# EAGLE design IR_beacon (EAGLE 9.2.2)
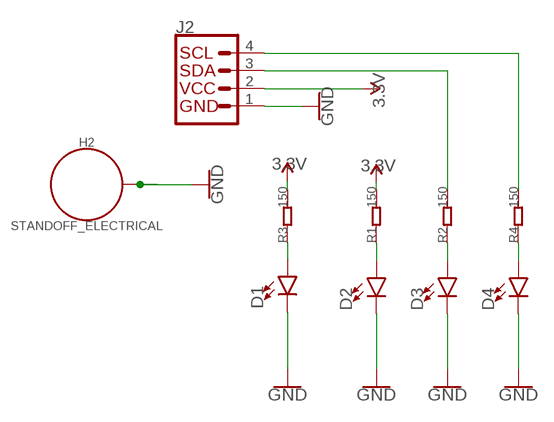
[diagram p0: schematic, sheet 1]

## Parts
D1  LED-FKIT-1206  [FKIT-LED-1206]
D2  LED-FKIT-1206  [FKIT-LED-1206]
D3  LED-FKIT-1206  [FKIT-LED-1206]
D4  LED-FKIT-1206  [FKIT-LED-1206]
H2  STANDOFF_ELECTRICAL  [STANDOFF-ELECTRICAL]
J2  QWIIC_CONNECTORJS-1MM  [1X04_1MM_RA]
R1  150  005-R0603_S  [0603_S]
R2  150  005-R0603_S  [0603_S]
R3  150  005-R0603_S  [0603_S]
R4  150  005-R0603_S  [0603_S]

## Nets
3.3V [5v]: J2.2 R1.2 R3.2
GND: D1.C D2.C D3.C D4.C H2.P1 J2.1
N$1: J2.4 R4.2
N$2: D1.A R3.1
N$3: D3.A R2.1
N$4: D2.A R1.1
N$5: D4.A R4.1
N$6: J2.3 R2.2

## Library data of the parts
D1-D4 = SparkFun-LED:LED: LED (Generic) Standard schematic elements and footprints for 5mm, 3mm, 1206, and 0603 sized LEDs. Generic LEDs with no color specified.
H2 = IAD-Library:STANDOFF_ELECTRICAL: Stand Off Drill holes with an electrical connection to ground your board to a chassis.
J2 = IAD-Library:QWIIC_CONNECTOR: JST SH 4 pin Vertical An SMD 1mm pitch JST connector The Part from Adafruit 4328 <https://www.adafruit.com/product/4328>. Sparkfun has 200mm <https://www.sparkfun.com/products/14204>, 100mm <https://www.sparkfun.com/products/14205>, 50mm <https://www.sparkfun.com/products/14206>, and breadboard friendly <https://www.sparkfun.com/products/14207> Qwiic cables. 10 pcs strips <https://www.sparkfun.com/products/14323> SMD connectors.; PROD_ID: CONN-13694
R1-R4 = Discrete:005-R*

## Net classes
0 default: width 0.4 mm, clearance 0.2 mm
1 5v: width 0.6 mm, clearance 0.2 mm

## Board
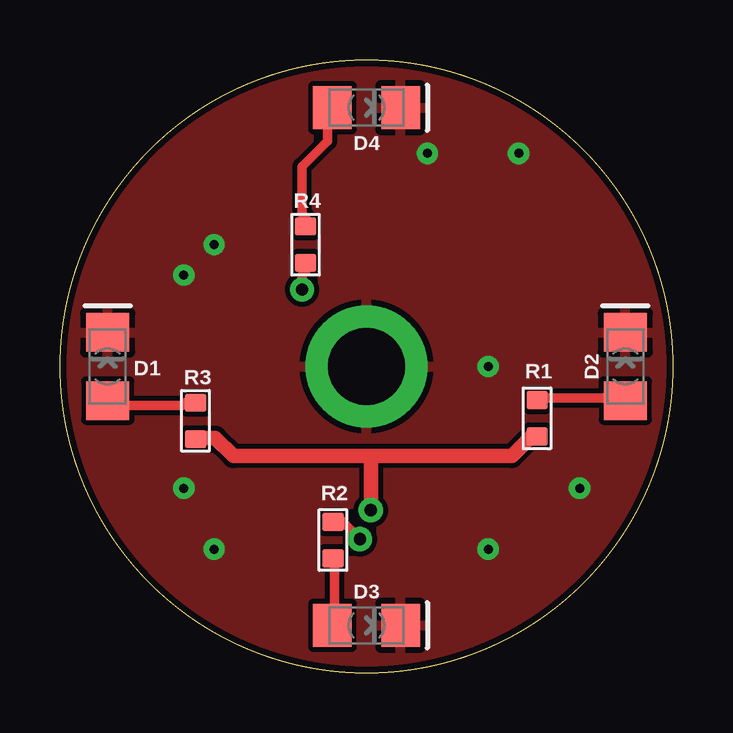
[diagram p1: board, top side]
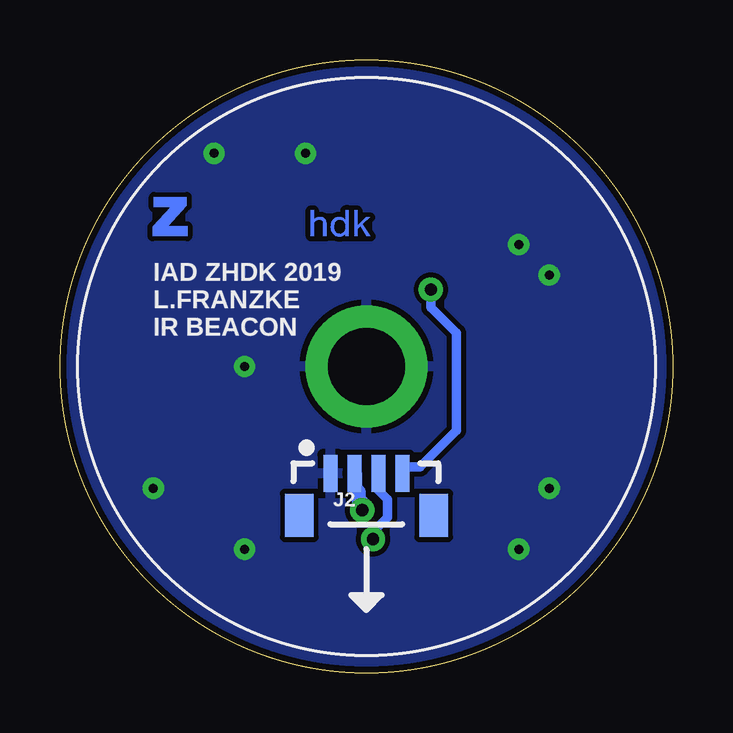
[diagram p2: board, bottom side, seen from below]

Size 25.56 x 25.56 mm. Coordinates in mm from the lower left corner, seen from the top.
Outline: circle at 12.78,12.78 radius 12.78
Copper layers (1*16): Top 0.035mm / dielectric 1.5mm / Bottom 0.035mm
Design rules "SparkFun": minimum track width 8mil, minimum drill 20mil, track to track 8mil, track to pad 8mil, pad to pad 8mil, via to via 8mil, smd to smd 8mil, copper to edge 10mil, drill to drill 8mil, minimum pad ring 12mil, minimum via ring 10mil, stop-mask expansion 4mil, vias tented up to drill 25mil, thermal gap 10mil

### Footprints (pad centres in the part's own frame; a part is rotated, then mirrored left to right if it is on the bottom)
FKIT-LED-1206 = smd 1.6 x 1.803: A -1.422,0; C 1.422,0
STANDOFF-ELECTRICAL = drill 3.2 pad 5.08: P1 0,0
1X04_1MM_RA = smd 0.6 x 1.55: 1 -1.5,-0.775; 2 -0.5,-0.775; 3 0.5,-0.775; 4 1.5,-0.775 | smd 1.2 x 1.8: NC1 2.8,-2.525; NC2 -2.8,-2.525
0603_S = smd 0.762 x 0.889: 1 -0.762,0; 2 0.762,0

### Placement (x,y rotation side)
D1  1.99,12.78 90 top
D2  23.58,12.78 90 top
D3  12.78,1.99 0 top
D4  12.78,23.58 0 top
H2  12.78,12.78 0 top
J2  12.78,9.1 0 bottom
R1  19.89,10.62 270 top
R2  11.38,5.54 90 top
R3  5.65,10.51 270 top
R4  10.24,17.86 270 top
U$2  [ZHDK_LOGO]  22.43,20.4 0 bottom

### Tracks (layer width: path | path; a pad name or v marks a point on that pad's centre or on a via)
3.3V  (via drill 0.51)
  Top 0.6: 12.96,9.05 18.84,9.05 19.75,9.95 R1.2 | 12.96,9.05 7.23,9.05 6.48,9.8 5.72,9.8 R3.2 | 12.96,9.05 v12.96,6.79
  Bottom 0.6: v12.96,6.79 12.96,7.09 13.11,7.24 13.11,7.54 13.26,7.69 13.26,8.29 J2.2
GND  (via drill 0.38)
  other vias: 5.16,7.7 6.43,17.86 15.32,21.67 17.86,5.16 17.86,12.78 19.13,21.67 21.67,7.7 5.16,16.59 6.43,5.16
  pour Top (isolate 0.1): -20.26,32.86 48.31,32.86 48.31,-7.55 -20.26,-7.55
  pour Bottom (isolate 0.1): -22.94,35.42 49.53,35.42 49.53,-9.58 -22.94,-9.58
N$1  (via drill 0.51)
  Top 0.4: v10.09,15.99 10.09,16.59 10.25,16.74 10.25,17.04 R4.2
  Bottom 0.4: v10.09,15.99 10.09,15.23 9.04,14.18 9.04,10.1 10.55,8.6 11.3,8.6 11.3,8.45 J2.4
N$2
  Top 0.4: R3.1 5.57,11.31 5.27,11.31 5.12,11.16 2.25,11.16 2.1,11.31 D1.A
N$3
  Top 0.4: R2.1 11.45,4.68 11.45,2.11 D3.A
N$4
  Top 0.4: R1.1 19.9,11.46 23.52,11.46 D2.A
N$5
  Top 0.4: R4.1 10.25,18.7 10.25,19 10.09,19.15 10.09,21.11 11.15,22.17 11.15,23.37 11.3,23.53 D4.A
N$6  (via drill 0.51)
  Top 0.4: v12.51,5.58 11.75,6.33 11.45,6.33 R2.2
  Bottom 0.4: v12.51,5.58 12.51,5.88 11.9,6.48 11.9,7.24 12.36,7.69 12.36,8.29 J2.3

### Text on the board
bPlace: IAD ZHDK 2019 | L.FRANZKE | IR BEACON